# EAGLE design Interconnect_board (EAGLE 9.3.0)
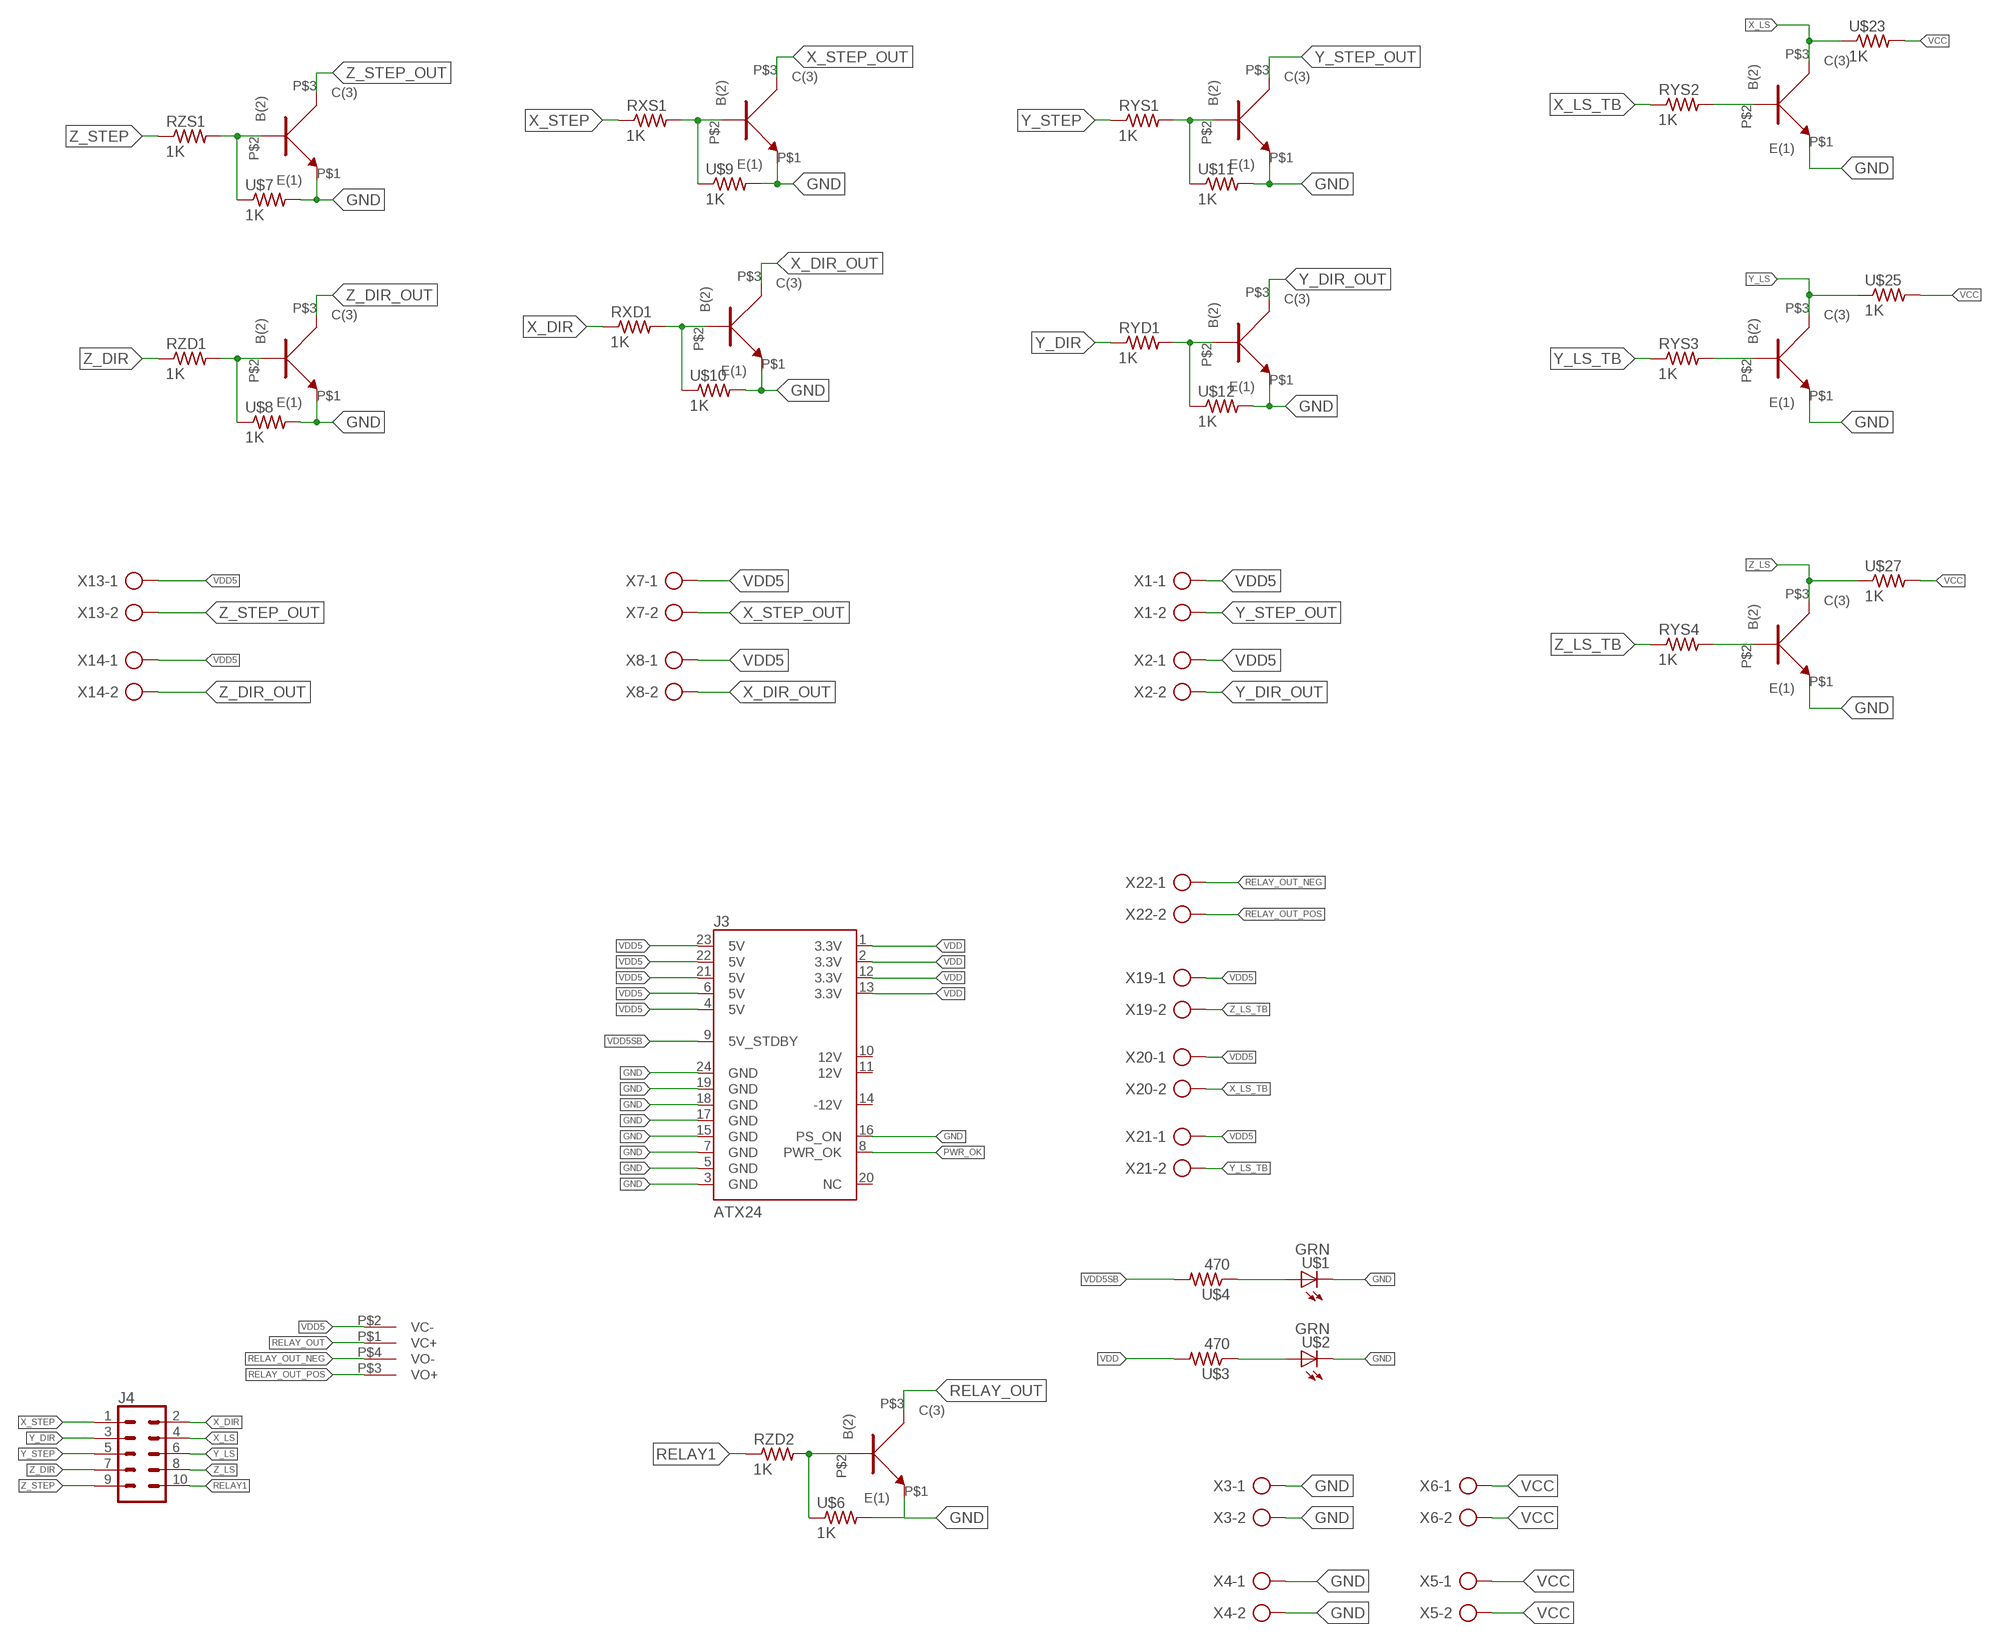
[diagram p0: schematic, sheet 1]

## Parts
J3  ATX24  [ATX24_STRAIGHT]
J4  CONN_05X2SHD  [2X5-SHROUDED]
RXD1  R_0805_1K  [R_0805_1K]
RXS1  R_0805_1K  [R_0805_1K]
RYD1  R_0805_1K  [R_0805_1K]
RYS1  R_0805_1K  [R_0805_1K]
RYS2  R_0805_1K  [R_0805_1K]
RYS3  R_0805_1K  [R_0805_1K]
RYS4  R_0805_1K  [R_0805_1K]
RZD1  R_0805_1K  [R_0805_1K]
RZD2  R_0805_1K  [R_0805_1K]
RZS1  R_0805_1K  [R_0805_1K]
U$1  LED_0805_GREEN  [LED_0805_GREEN]
U$2  LED_0805_GREEN  [LED_0805_GREEN]
U$3  R_0805_470  [R_0805_470]
U$4  R_0805_470  [R_0805_470]
U$5  RELAY_KYOTO_KF0604D  [RELAY_KYOTO_KF0604D]
U$6  R_0805_1K  [R_0805_1K]
U$7  R_0805_1K  [R_0805_1K]
U$8  R_0805_1K  [R_0805_1K]
U$9  R_0805_1K  [R_0805_1K]
U$10  R_0805_1K  [R_0805_1K]
U$11  R_0805_1K  [R_0805_1K]
U$12  R_0805_1K  [R_0805_1K]
U$13  TRANS_NPN  [TO_92_STRAIGHT]
U$14  TRANS_NPN  [TO_92_STRAIGHT]
U$15  TRANS_NPN  [TO_92_STRAIGHT]
U$16  TRANS_NPN  [TO_92_STRAIGHT]
U$17  TRANS_NPN  [TO_92_STRAIGHT]
U$18  TRANS_NPN  [TO_92_STRAIGHT]
U$19  TRANS_NPN  [TO_92_STRAIGHT]
U$23  R_0805_1K  [R_0805_1K]
U$24  TRANS_NPN  [TO_92_STRAIGHT]
U$25  R_0805_1K  [R_0805_1K]
U$26  TRANS_NPN  [TO_92_STRAIGHT]
U$27  R_0805_1K  [R_0805_1K]
U$28  TRANS_NPN  [TO_92_STRAIGHT]
X1  AK300/2  [AK300/2]
X2  AK300/2  [AK300/2]
X3  AK300/2  [AK300/2]
X4  AK300/2  [AK300/2]
X5  AK300/2  [AK300/2]
X6  AK300/2  [AK300/2]
X7  AK300/2  [AK300/2]
X8  AK300/2  [AK300/2]
X13  AK300/2  [AK300/2]
X14  AK300/2  [AK300/2]
X19  AK300/2  [AK300/2]
X20  AK300/2  [AK300/2]
X21  AK300/2  [AK300/2]
X22  AK300/2  [AK300/2]

## Nets
GND: J3.3(GND) J3.5(GND) J3.7(GND) J3.15(GND) J3.16(PS_ON) J3.17(GND) J3.18(GND) J3.19(GND) J3.24(GND) U$1.C U$2.C U$6.2 U$7.2 U$8.2 U$9.2 U$10.2 U$11.2 U$12.2 U$13.P$1(E(1)) U$14.P$1(E(1)) U$15.P$1(E(1)) U$16.P$1(E(1)) U$17.P$1(E(1)) U$18.P$1(E(1)) U$19.P$1(E(1)) U$24.P$1(E(1)) U$26.P$1(E(1)) U$28.P$1(E(1)) X3.1 X3.2 X4.1 X4.2
N$1: RXS1.2 U$9.1 U$15.P$2(B(2))
N$2: RYS2.2 U$24.P$2(B(2))
N$3: RZD1.2 U$8.1 U$14.P$2(B(2))
N$4: U$1.A U$4.1
N$5: U$2.A U$3.1
N$6: RYS3.2 U$26.P$2(B(2))
N$7: RZS1.2 U$7.1 U$13.P$2(B(2))
N$8: RZD2.2 U$6.1 U$19.P$2(B(2))
N$9: RYS1.2 U$11.1 U$18.P$2(B(2))
N$10: RYS4.2 U$28.P$2(B(2))
N$15: RXD1.2 U$10.1 U$16.P$2(B(2))
N$18: RYD1.2 U$12.1 U$17.P$2(B(2))
PWR_OK: J3.8(PWR_OK)
RELAY1: J4.10 RZD2.1
RELAY_OUT: U$5.P$1(VC+) U$19.P$3(C(3))
RELAY_OUT_NEG: U$5.P$4(VO-) X22.1
RELAY_OUT_POS: U$5.P$3(VO+) X22.2
VCC: U$23.2 U$25.2 U$27.2 X5.1 X5.2 X6.1 X6.2
VDD: J3.1(3.3V) J3.2(3.3V) J3.12(3.3V) J3.13(3.3V) U$3.2
VDD5: J3.4(5V) J3.6(5V) J3.21(5V) J3.22(5V) J3.23(5V) U$5.P$2(VC-) X1.1 X2.1 X7.1 X8.1 X13.1 X14.1 X19.1 X20.1 X21.1
VDD5SB: J3.9(5V_STDBY) U$4.2
X_DIR: J4.2 RXD1.1
X_DIR_OUT: U$16.P$3(C(3)) X8.2
X_LS: J4.4 U$23.1 U$24.P$3(C(3))
X_LS_TB: RYS2.1 X20.2
X_STEP: J4.1 RXS1.1
X_STEP_OUT: U$15.P$3(C(3)) X7.2
Y_DIR: J4.3 RYD1.1
Y_DIR_OUT: U$17.P$3(C(3)) X2.2
Y_LS: J4.6 U$25.1 U$26.P$3(C(3))
Y_LS_TB: RYS3.1 X21.2
Y_STEP: J4.5 RYS1.1
Y_STEP_OUT: U$18.P$3(C(3)) X1.2
Z_DIR: J4.7 RZD1.1
Z_DIR_OUT: U$14.P$3(C(3)) X14.2
Z_LS: J4.8 U$27.1 U$28.P$3(C(3))
Z_LS_TB: RYS4.1 X19.2
Z_STEP: J4.9 RZS1.1
Z_STEP_OUT: U$13.P$3(C(3)) X13.2
Unconnected: J3.10(12V) J3.11(12V) J3.14(-12V) J3.20(NC)

## Library data of the parts
J3 = 3D_MIG_Controller:ATX24: ATX24 Pin Power Supply Connector - Right Angle PTH Mount This is a good connector for connecting a computer power supply to a PCB. It's massive, but provides many amps of power at 5V and 12V. SparkFun Products: SparkFun Benchtop Power Board Kit <https://www.sparkfun.com/products/12867> SparkFun Power Driver Shield Kit <https://www.sparkfun.com/products/10618>
J4 = 3D_MIG_Controller:CONN_05X2: Multi connection point. Often used as Generic Header-pin footprint for 0.1 inch spaced/style header connections For AVR SPI programming port, see special device with nice symbol: "AVR_SPI_PROG_5x2.dev" You can populate with any combo of single row headers, but if you'd like an exact match, check these: 2x5 AVR ICSP Male Header <https://www.sparkfun.com/products/778> (PRT-00778) 2x5 Pin Shrouded Header <https://www.sparkfun.com/products/8506> (PRT-08506) On any of the 0.1 inch spaced packages, you can populate with these: Break Away Headers - Straight <https://www.sparkfun.com/products/116> (PRT-00116) Break Away Male Headers - Right Angle <https://www.sparkfun.com/products/553> (PRT-00553) Female Headers <https://www.sparkfun.com/products/115> (PRT-00115) Break Away Headers - Machine Pin <https://www.sparkfun.com/products/117> (PRT-00117) Break Away Female Headers - Swiss Machine Pin <https://www.sparkfun.com/products/743> (PRT-00743) Special note: the shrouded connector mates well with our 5x2 ribbon cables: 2x5 Pin IDC Ribbon Cable <https://www.sparkfun.com/products/8535> (PRT-08535); PROD_ID: CONN-08671; SF_ID: PRT-08506
RXD1 RXS1 RYD1 RYS1-RYS4 RZD1 RZD2 RZS1 U$6-U$12 U$23 U$25 U$27 = 3D_MIG_Controller:R_0805_1K
U$1 U$2 = 3D_MIG_Controller:LED_0805_GREEN
U$3 U$4 = 3D_MIG_Controller:R_0805_470
U$5 = 3D_MIG_Controller:RELAY_KYOTO_KF0604D
U$13-U$19 U$24 U$26 U$28 = 3D_MIG_Controller:TRANS_NPN
X1-X8 X13 X14 X19-X22 = 3D_MIG_Controller:AK300/2: CONNECTOR; OC_FARNELL: unknown; OC_NEWARK: unknown

## Board
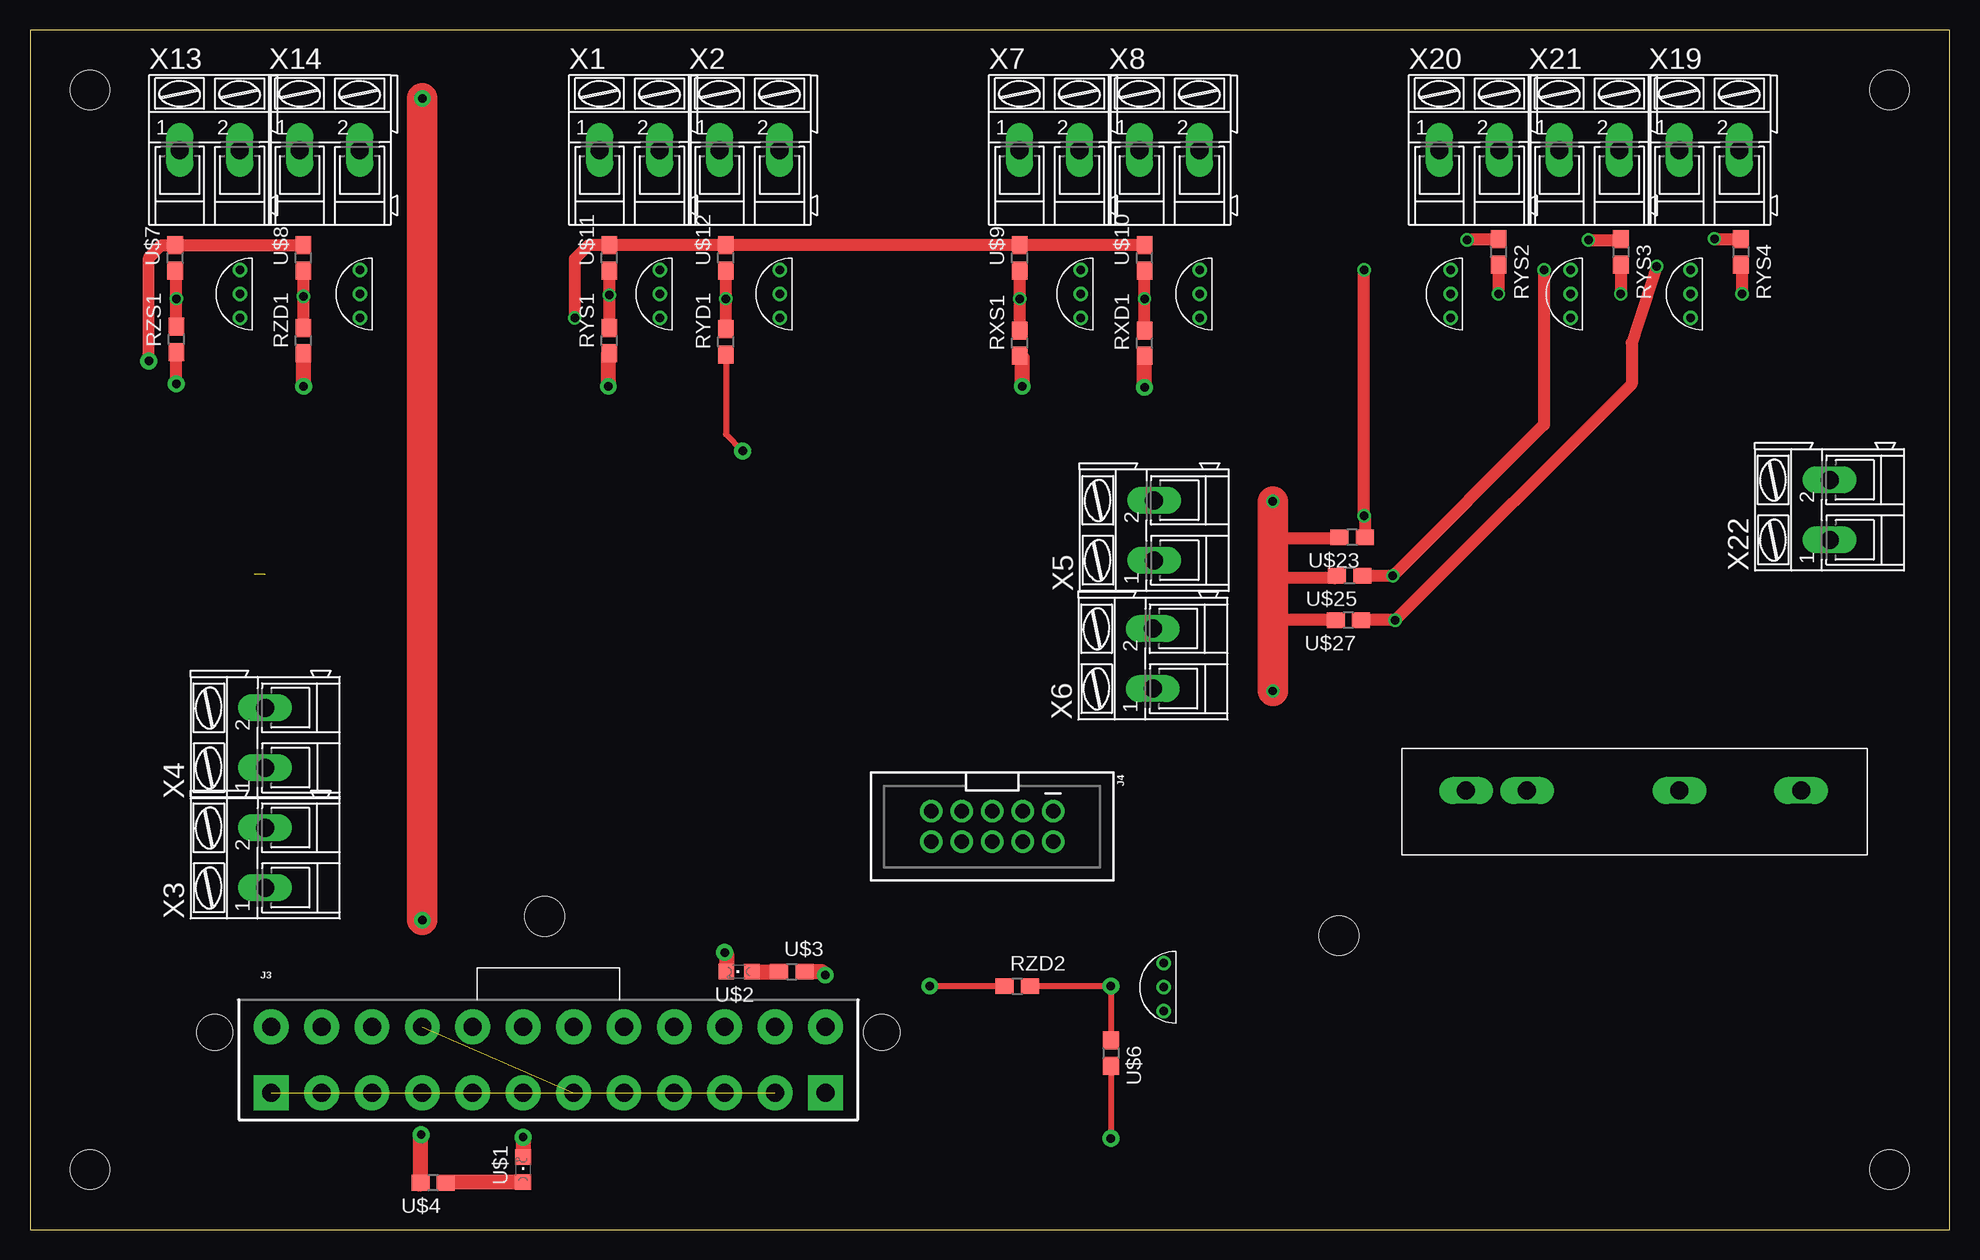
[diagram p1: board, top side]
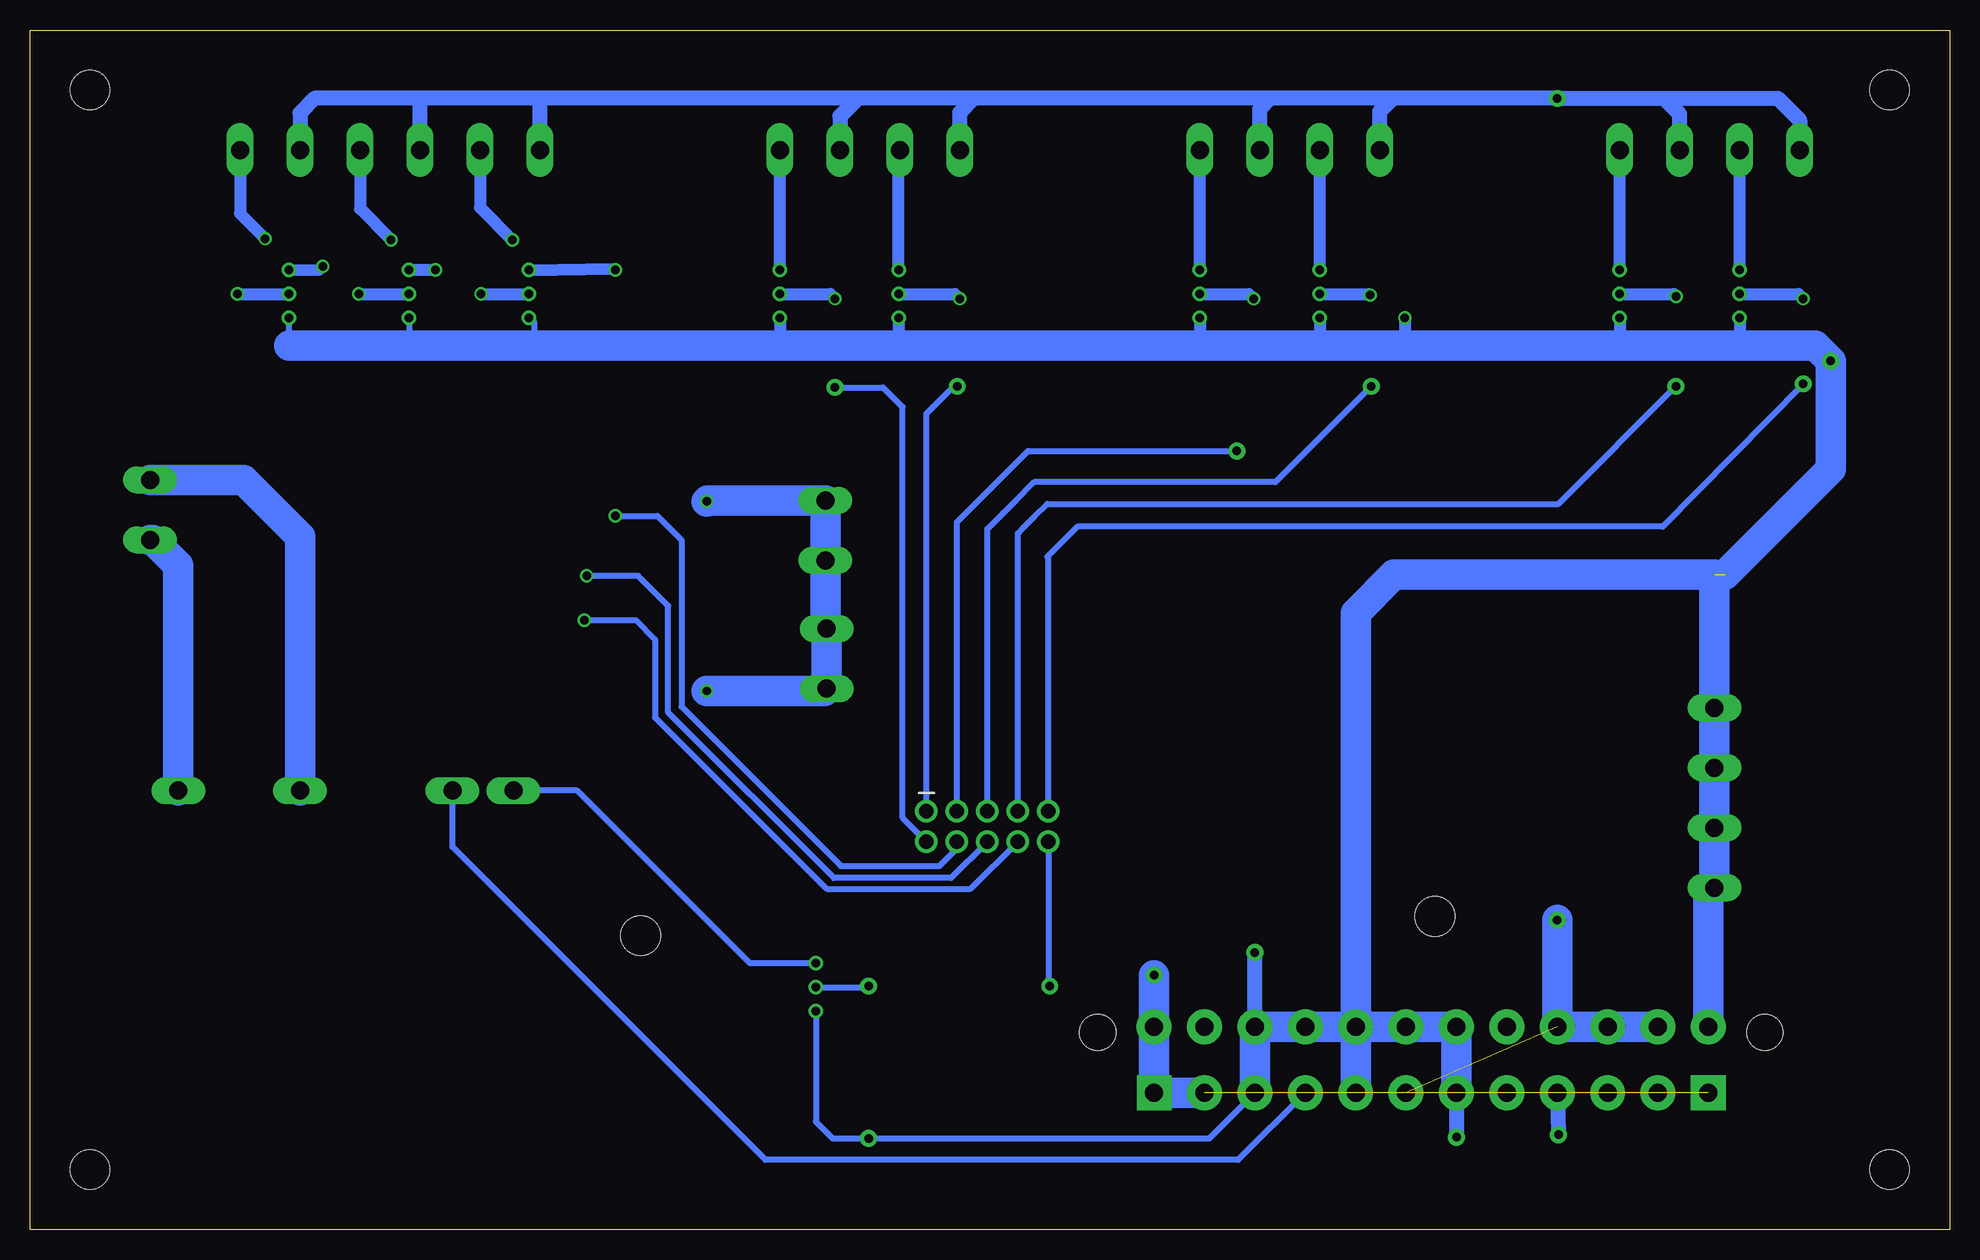
[diagram p2: board, bottom side, seen from below]

Size 160 x 100 mm. Coordinates in mm from the lower left corner, seen from the top.
Outline: 0,0 160,0 160,100 0,100 0,0
Copper layers (1*16): Top 0.035mm / dielectric 1.5mm / Bottom 0.035mm
Design rules "default": minimum track width 6mil, minimum drill 0.35mm, track to track 6mil, track to pad 6mil, pad to pad 6mil, via to via 6mil, smd to smd 6mil, copper to edge 40mil, drill to drill 6mil, minimum pad ring 10mil, minimum via ring 8mil, stop-mask expansion 4mil, vias tented up to drill 0mil, thermal gap 10mil
Holes 3.3 mm at 5,95 5,5 155,5 155,95 42.9,26.1 109.1,24.5

### Footprints (pad centres in the part's own frame; a part is rotated, then mirrored left to right if it is on the bottom)
ATX24_STRAIGHT = drill 1.5 pad 2.9 square: 1 23.1,-5.5; 12 -23.1,-5.5 | drill 1.5 pad 2.9: 2 18.9,-5.5; 3 14.7,-5.5; 4 10.5,-5.5; 5 6.3,-5.5; 6 2.1,-5.5; 7 -2.1,-5.5; 8 -6.3,-5.5; 9 -10.5,-5.5; 10 -14.7,-5.5; 11 -18.9,-5.5; 13 23.1,0; 14 18.9,0; 15 14.7,0; 16 10.5,0; 17 6.3,0; 18 2.1,0; 19 -2.1,0; 20 -6.3,0; 21 -10.5,0; 22 -14.7,0; 23 -18.9,0; 24 -23.1,0 | hole 3: -27.8,-0.46; 27.8,-0.46
2X5-SHROUDED = drill 1.2 pad 1.88: 1 -1.27,5.08; 2 1.27,5.08; 3 -1.27,2.54; 4 1.27,2.54; 5 -1.27,0; 6 1.27,0; 7 -1.27,-2.54; 8 1.27,-2.54; 9 -1.27,-5.08; 10 1.27,-5.08
R_0805_1K = smd 1.5 x 1.3: 1 -1.052,0; 2 1.052,0
LED_0805_GREEN = smd 1.3 x 1.3: A 0,-1.05; C 0,1.05
R_0805_470 = smd 1.5 x 1.3: 1 -1.052,0; 2 1.052,0
RELAY_KYOTO_KF0604D = drill 1.5 long: P$1 0,0; P$2 -5.08,0; P$3 -17.78,0; P$4 -27.94,0
TO_92_STRAIGHT = drill 0.7: P$1 -2,0; P$2 0,0; P$3 2,0
AK300/2 = drill 1.5 long: 1 -2.515,0; 2 2.489,0

### Placement (x,y rotation side)
J3  43.2,16.9 0 top
J4  80.2,33.6 270 top
RXD1  92.9,73.9 90 top
RXS1  82.5,73.9 90 top
RYD1  58,74 90 top
RYS1  48.3,74.1 90 top
RYS2  122.4,81.5 270 top
RYS3  132.6,81.5 270 top
RYS4  142.6,81.5 270 top
RZD1  22.8,74.1 90 top
RZD2  82.3,20.3 0 top
RZS1  12.2,74.2 90 top
U$1  41.1,5 0 top
U$2  59.1,21.5 90 top
U$3  63.5,21.5 0 top
U$4  33.6,3.9 180 top
U$5  119.7,36.6 180 top
U$6  90.1,14.7 270 top
U$7  12.1,81 90 top
U$8  22.8,81 90 top
U$9  82.5,81 90 top
U$10  92.9,81 90 top
U$11  48.3,81 90 top
U$12  58,81 90 top
U$13  17.5,78 90 top
U$14  27.5,78 90 top
U$15  87.6,78 90 top
U$16  97.5,78 90 top
U$17  62.5,78 90 top
U$18  52.5,78 90 top
U$19  94.5,20.2 90 top
U$23  110.2,57.7 180 top
U$24  118.4,78 90 top
U$25  110,54.5 180 top
U$26  128.4,78 90 top
U$27  109.9,50.8 180 top
U$28  138.4,78 90 top
X1  50,90 0 top
X2  60,90 0 top
X3  19.6,31 90 top
X4  19.6,41 90 top
X5  93.7,58.3 90 top
X6  93.6,47.6 90 top
X7  85,90 0 top
X8  95,90 0 top
X13  15,90 0 top
X14  25,90 0 top
X19  140,90 0 top
X20  120,90 0 top
X21  130,90 0 top
X22  150,60 90 top

### Tracks (layer width: path | path; a pad name or v marks a point on that pad's centre or on a via)
GND  (via drill 0.7, 0.7 pad 1.4)  (1 unrouted)
  Top 0.508: U$6.2 v90.1,7.6
  Top 1.016: v9.9,72.4 9.9,81 10.95,82.05 U$7.2 U$8.2 | U$10.2 U$9.2 U$12.2 U$11.2 46.55,82.05 45.4,80.9 v45.4,76
  Top 1.27: v41.1,7.7 U$1.C | v57.9,23.1 58.05,22.95 U$2.C
  Bottom 0.508: J3.3 61.7,7.6 v90.1,7.6 93.1,7.6 94.5,9 U$19.P$1 | 138.4,73.7 U$28.P$1 | U$26.P$1 128.4,73.7 | U$24.P$1 118,75.7 118,73.7
  Bottom 1.016: U$13.P$1 17.5,73.7 | U$14.P$1 27.5,73.8 27.6,73.7 | v45.4,76 45.4,73.7 | U$18.P$1 52.5,73.7 | U$17.P$1 62.5,73.7 | U$15.P$1 87.6,73.7 | U$16.P$1 97.5,74.2 97,73.7 | 49.6,28.9 49.5,28.8 | 49.7,37.8 49.5,37.6
  Bottom 1.27: J3.7 v41.1,7.7 | J3.15 v57.9,23.1
  Bottom 2.54: J3.3 J3.15 J3.16 J3.17 | J3.5 J3.17 | J3.7 J3.19 J3.18 J3.17 | J3.17 49.5,28.8 49.5,37.6 49.5,51.4 46.3,54.6 19.6,54.6 X4.2 X4.1 X3.2 X3.1 20.1,27.98 J3.24 | 18.7,54.6 9.9,63.4 v9.9,72.4 11.2,73.7 17.5,73.7 27.6,73.7 45.4,73.7 52.5,73.7 62.5,73.7 87.6,73.7 97,73.7 118,73.7 128.4,73.7 138.4,73.7
N$1  (via drill 0.7)
  Top 1.016: RXS1.2 v82.5,77.6 U$9.1
  Bottom 1.016: U$15.P$2 82.9,78 v82.5,77.6
N$2  (via drill 0.7)
  Top 1.016: 122.3,80.35 RYS2.2 v122.4,78
  Bottom 1.016: v122.4,78 U$24.P$2
N$3  (via drill 0.7)
  Top 1.016: RZD1.2 v22.8,77.8 U$8.1
  Bottom 1.016: U$14.P$2 23,78 v22.8,77.8
N$4
  Top 1.27: U$1.A 34.7,3.95 U$4.1
N$5
  Top 1.27: U$2.A U$3.1
N$6  (via drill 0.7)
  Top 1.016: RYS3.2 v132.6,78
  Bottom 1.016: v132.6,78 U$26.P$2
N$7  (via drill 0.7)
  Top 1.016: 12.1,75.35 RZS1.2 v12.2,77.6 12.2,79.85 U$7.1
  Bottom 1.016: U$13.P$2 12.6,78 v12.2,77.6
N$8  (via drill 0.7 pad 1.4)
  Top 0.508: RZD2.2 v90.1,20.3 U$6.1
  Bottom 0.508: U$19.P$2 90.2,20.2 v90.1,20.3
N$9  (via drill 0.7)
  Top 1.016: RYS1.2 v48.3,77.9 U$11.1
  Bottom 1.016: U$18.P$2 48.4,78 v48.3,77.9
N$10  (via drill 0.7)
  Top 1.016: RYS4.2 142.7,80.35 v142.7,78
  Bottom 1.016: v142.7,78 U$28.P$2
N$15  (via drill 0.7)
  Top 1.016: RXD1.2 v92.9,77.6 U$10.1
  Bottom 1.016: U$16.P$2 93.3,78 v92.9,77.6
N$18  (via drill 0.7)
  Top 1.016: RYD1.2 v58,77.6 U$12.1
  Bottom 1.016: U$17.P$2 58.4,78 v58,77.6
RELAY1  (via drill 0.7 pad 1.4)
  Top 0.508: v75,20.3 RZD2.1
  Bottom 0.508: J4.10 75.12,20.42 v75,20.3
RELAY_OUT
  Bottom 0.508: U$19.P$3 100,22.2 114.4,36.6 U$5.P$1
RELAY_OUT_NEG
  Bottom 2.54: U$5.P$4 147.64,55.34 149.78,57.48 X22.1
RELAY_OUT_POS
  Bottom 2.54: U$5.P$3 137.48,57.78 142.19,62.49 X22.2
VCC  (via drill 0.7)
  Top 1.016: U$23.2 109.05,57.6 103.6,57.6 | U$25.2 108.75,54.3 103.6,54.3 | U$27.2 103.8,50.8 103.6,51
  Top 2.54: v103.6,60.7 103.6,57.6 103.6,54.3 103.6,51 v103.6,44.9
  Bottom 2.54: v103.6,60.7 103.51,60.79 X5.2 X5.1 93.7,50.19 X6.2 X6.1 93.78,44.9 v103.6,44.9
VDD  (via drill 0.7 pad 1.4)  (1 unrouted)
  Top 1.27: v66.3,21.2 66,21.5 U$3.2
  Bottom 2.54: v66.3,21.2 J3.13 J3.1 J3.2
VDD5  (via drill 0.7 pad 1.4)  (2 unrouted)
  Top 2.54: v32.7,25.8 v32.7,94.3
  Bottom 0.508: J3.4 59.3,5.8 98.7,5.8 124.78,31.88 U$5.P$2
  Bottom 1.27: 23.8,94.3 v32.7,94.3 46.4,94.3 | 23.8,94.3 14.3,94.3 12.48,92.48 X13.1 | X14.1 22.48,92.98 23.8,94.3 | 46.4,94.3 56.6,94.3 | 56.6,94.3 81.3,94.3 | 81.3,94.3 91,94.3 | X8.1 92.48,92.81 91,94.3 | X7.1 82.48,93.11 81.3,94.3 | X1.1 47.48,93.22 46.4,94.3 | X2.1 57.48,93.42 56.6,94.3 | 91,94.3 117.1,94.3 | 117.1,94.3 127.2,94.3 | 127.2,94.3 136.3,94.3 137.5,93.1 137.49,93.08 X19.1 | X21.1 127.48,94.02 127.2,94.3 | X20.1 117.48,93.92 117.1,94.3
  Bottom 2.54: J3.23 J3.22 J3.21 v32.7,25.8
VDD5SB  (via drill 0.7 pad 1.4)
  Top 1.27: 32.45,3.8 U$4.2 32.55,7.85 v32.6,7.9
  Bottom 1.27: J3.9 v32.6,7.9
X_DIR  (via drill 0.7 pad 1.4)
  Top 1.27: v92.9,70.2 RXD1.1
  Bottom 0.508: v92.9,70.2 88.9,70.2 87.27,68.57 87.27,34.32 J4.2
X_DIR_OUT
  Bottom 1.016: U$16.P$3 X8.2
X_LS  (via drill 0.7)
  Top 1.016: U$23.1 111.25,59.45 v111.2,59.5 v111.2,80
  Bottom 0.508: v111.2,59.5 107.7,59.5 105.7,57.5 105.7,43.6 92.4,30.3 84.2,30.3 82.74,31.76 J4.4
  Bottom 1.016: U$24.P$3 111.3,80.1 v111.2,80
X_LS_TB  (via drill 0.7)
  Top 1.016: v119.8,82.5 119.85,82.55 RYS2.1
  Bottom 1.016: X20.2 122.49,85.19 v119.8,82.5
X_STEP  (via drill 0.7 pad 1.4)
  Top 1.27: RXS1.1 82.7,72.65 v82.7,70.3
  Bottom 0.508: v82.7,70.3 83,70.3 84.1,69.2 84.73,68.57 85.28,68.02 J4.1
X_STEP_OUT
  Bottom 1.016: U$15.P$3 87.6,89.89 X7.2
Y_DIR  (via drill 0.7 pad 1.4)
  Top 0.508: RYD1.1 58,66.3 v59.4,64.9
  Bottom 0.508: v59.4,64.9 76.8,64.9 79.85,61.85 80.8,60.9 82.74,58.96 J4.3
Y_DIR_OUT
  Bottom 1.016: U$17.P$3 X2.2
Y_LS  (via drill 0.7)
  Top 1.016: U$25.1 v113.6,54.5 126.2,67.1 v126.2,80
  Bottom 0.508: J4.6 83.23,29.3 93,29.3 106.8,43.1 106.8,52 109.3,54.5 v113.6,54.5
  Bottom 1.016: v126.2,80 U$26.P$3
Y_LS_TB  (via drill 0.7)
  Top 1.016: v129.9,82.5 132.55,82.5 RYS3.1
  Bottom 1.016: X21.2 132.49,85.09 v129.9,82.5
Y_STEP  (via drill 0.7 pad 1.4)
  Top 1.27: RYS1.1 48.2,72.95 v48.2,70.3
  Bottom 0.508: 48.3,70.2 v48.2,70.3 56.2,62.3 76.3,62.3 77.85,60.75 78.9,59.7 80.2,58.4 J4.5
Y_STEP_OUT
  Bottom 1.016: U$18.P$3 X1.2
Z_DIR  (via drill 0.7 pad 1.4)
  Top 1.27: v22.8,70.3 RZD1.1
  Bottom 0.508: v22.8,70.3 32.6,60.5 75.2,60.5 76.3,59.4 77.3,58.4 77.66,58.04 J4.7
Z_DIR_OUT
  Bottom 1.016: U$14.P$3 X14.2
Z_LS  (via drill 0.7)
  Top 1.016: v135.6,80.3 133.5,73.9 133.5,70.5 v113.8,50.8 U$27.1
  Bottom 0.508: v113.8,50.8 109.5,50.8 107.9,49.2 107.9,42.7 93.6,28.4 81.59,28.4 J4.8
  Bottom 1.016: U$28.P$3 135.9,80 v135.6,80.3
Z_LS_TB  (via drill 0.7)
  Top 1.016: v140.4,82.6 140.45,82.55 RYS4.1
  Bottom 1.016: X19.2 142.49,84.69 v140.4,82.6
Z_STEP  (via drill 0.7 pad 1.4)
  Top 1.016: v12.2,70.5 RZS1.1
  Bottom 0.508: v12.2,70.5 23.9,58.6 72.7,58.6 75.12,56.18 | 75.12,56.18 75.2,56.1 | J4.9 75.12,56.18
Z_STEP_OUT
  Bottom 1.016: U$13.P$3 X13.2